# Altium schematic sheet main.SchDoc
size A0
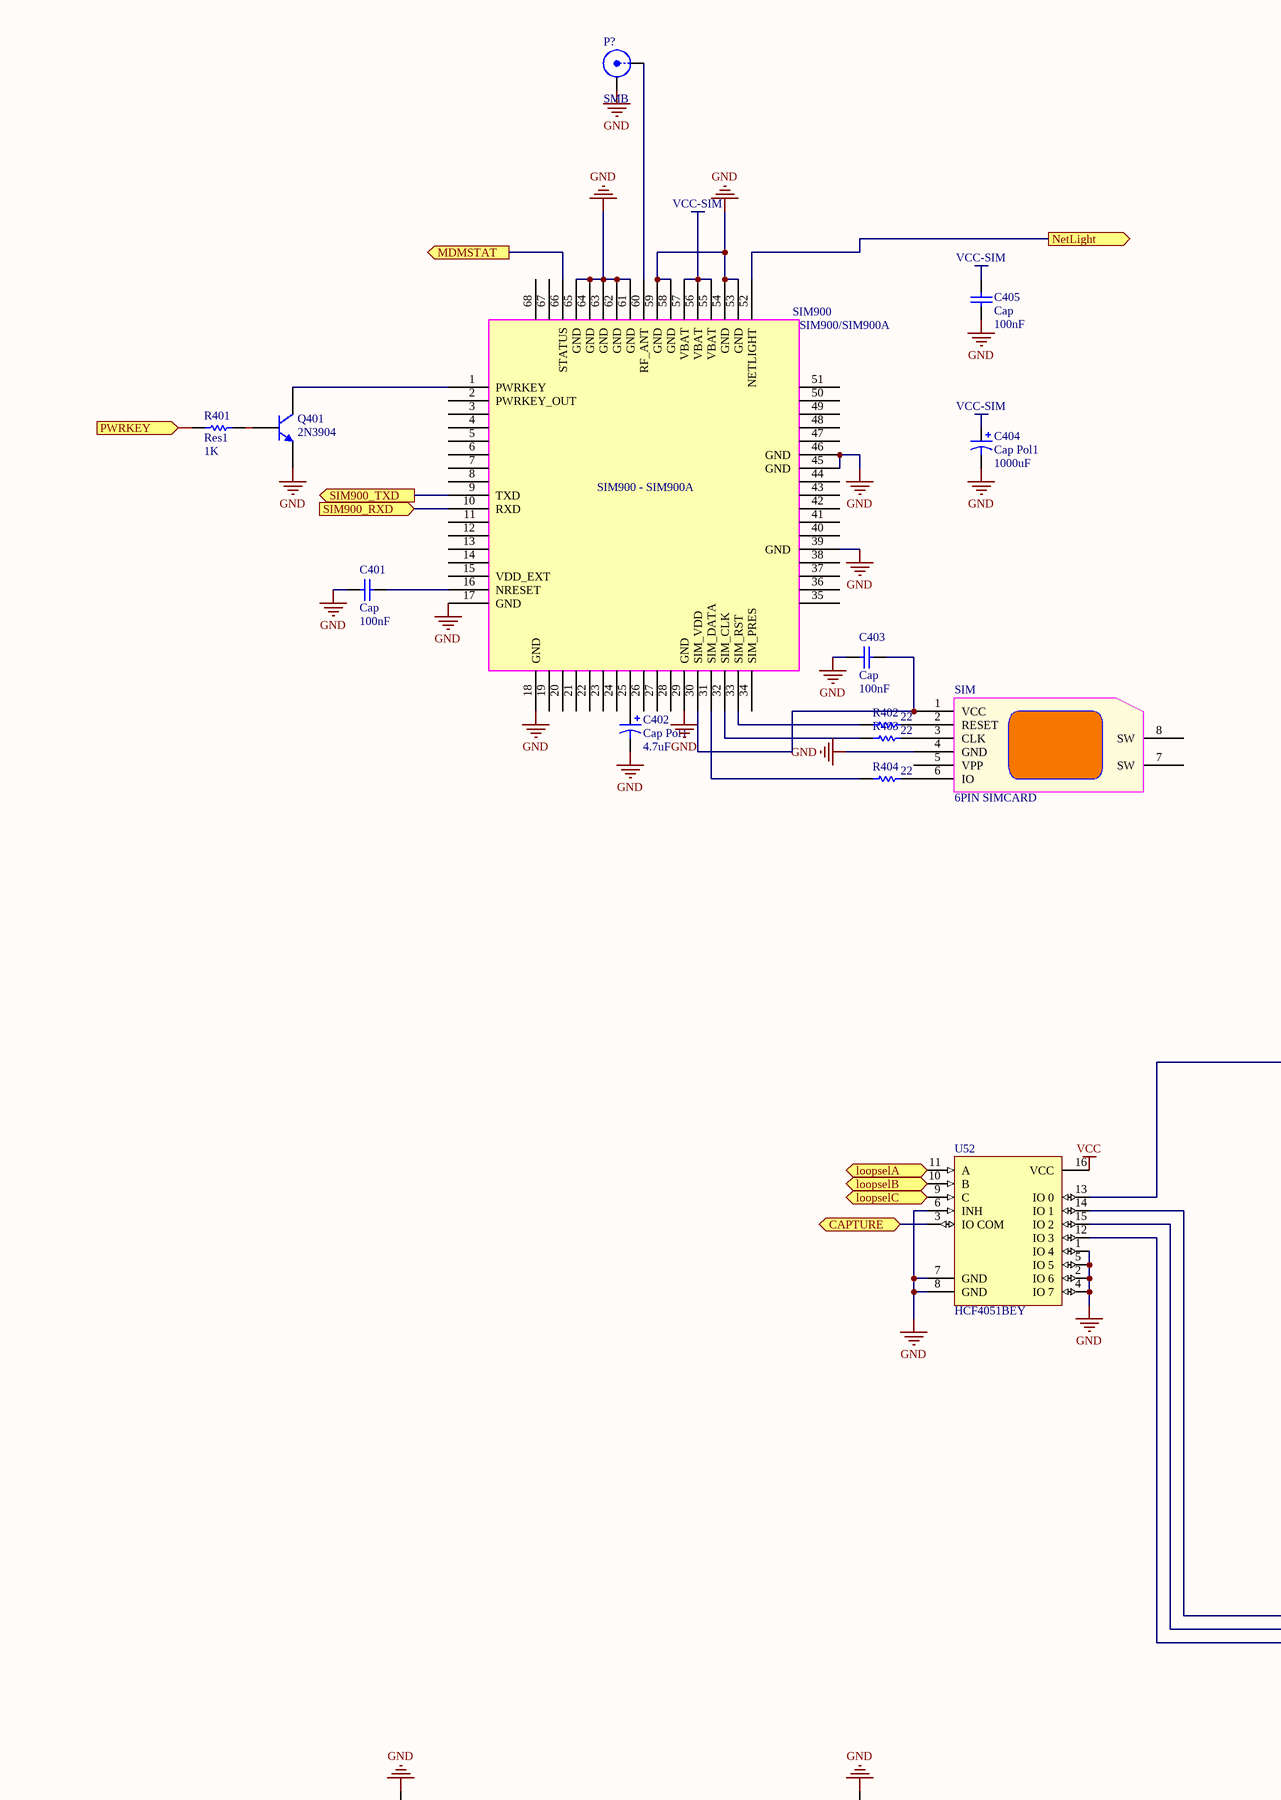
[diagram p0: main.SchDoc, top left]
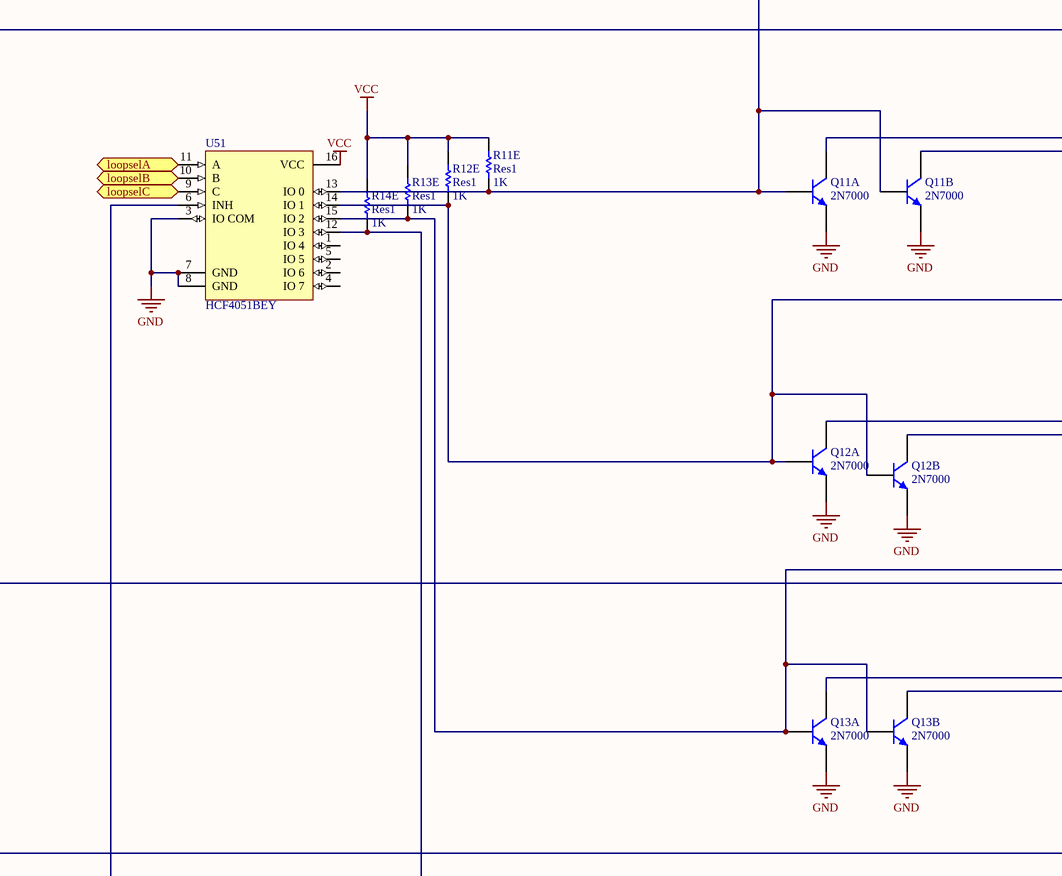
[diagram p1: main.SchDoc, top middle]
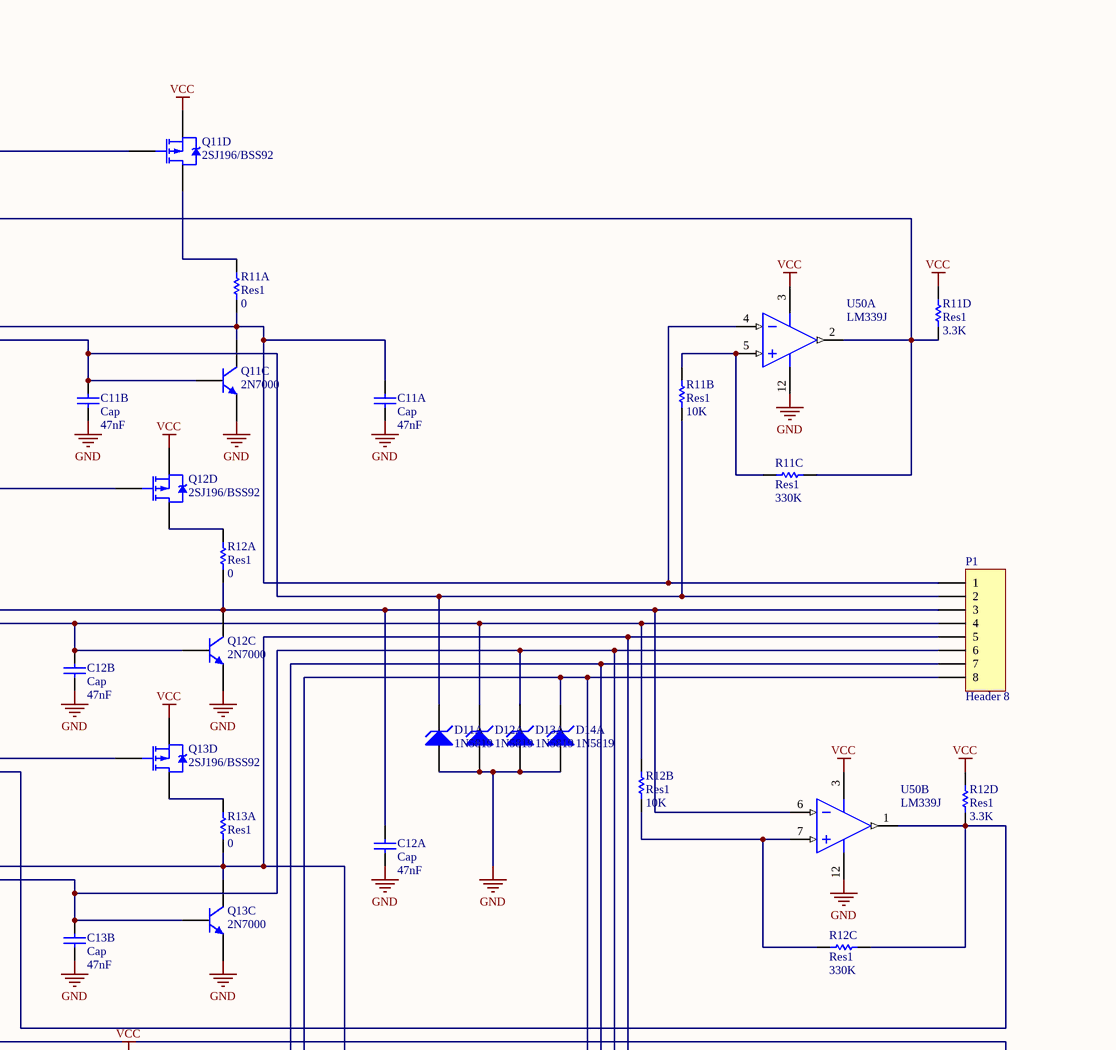
[diagram p2: main.SchDoc, top right]
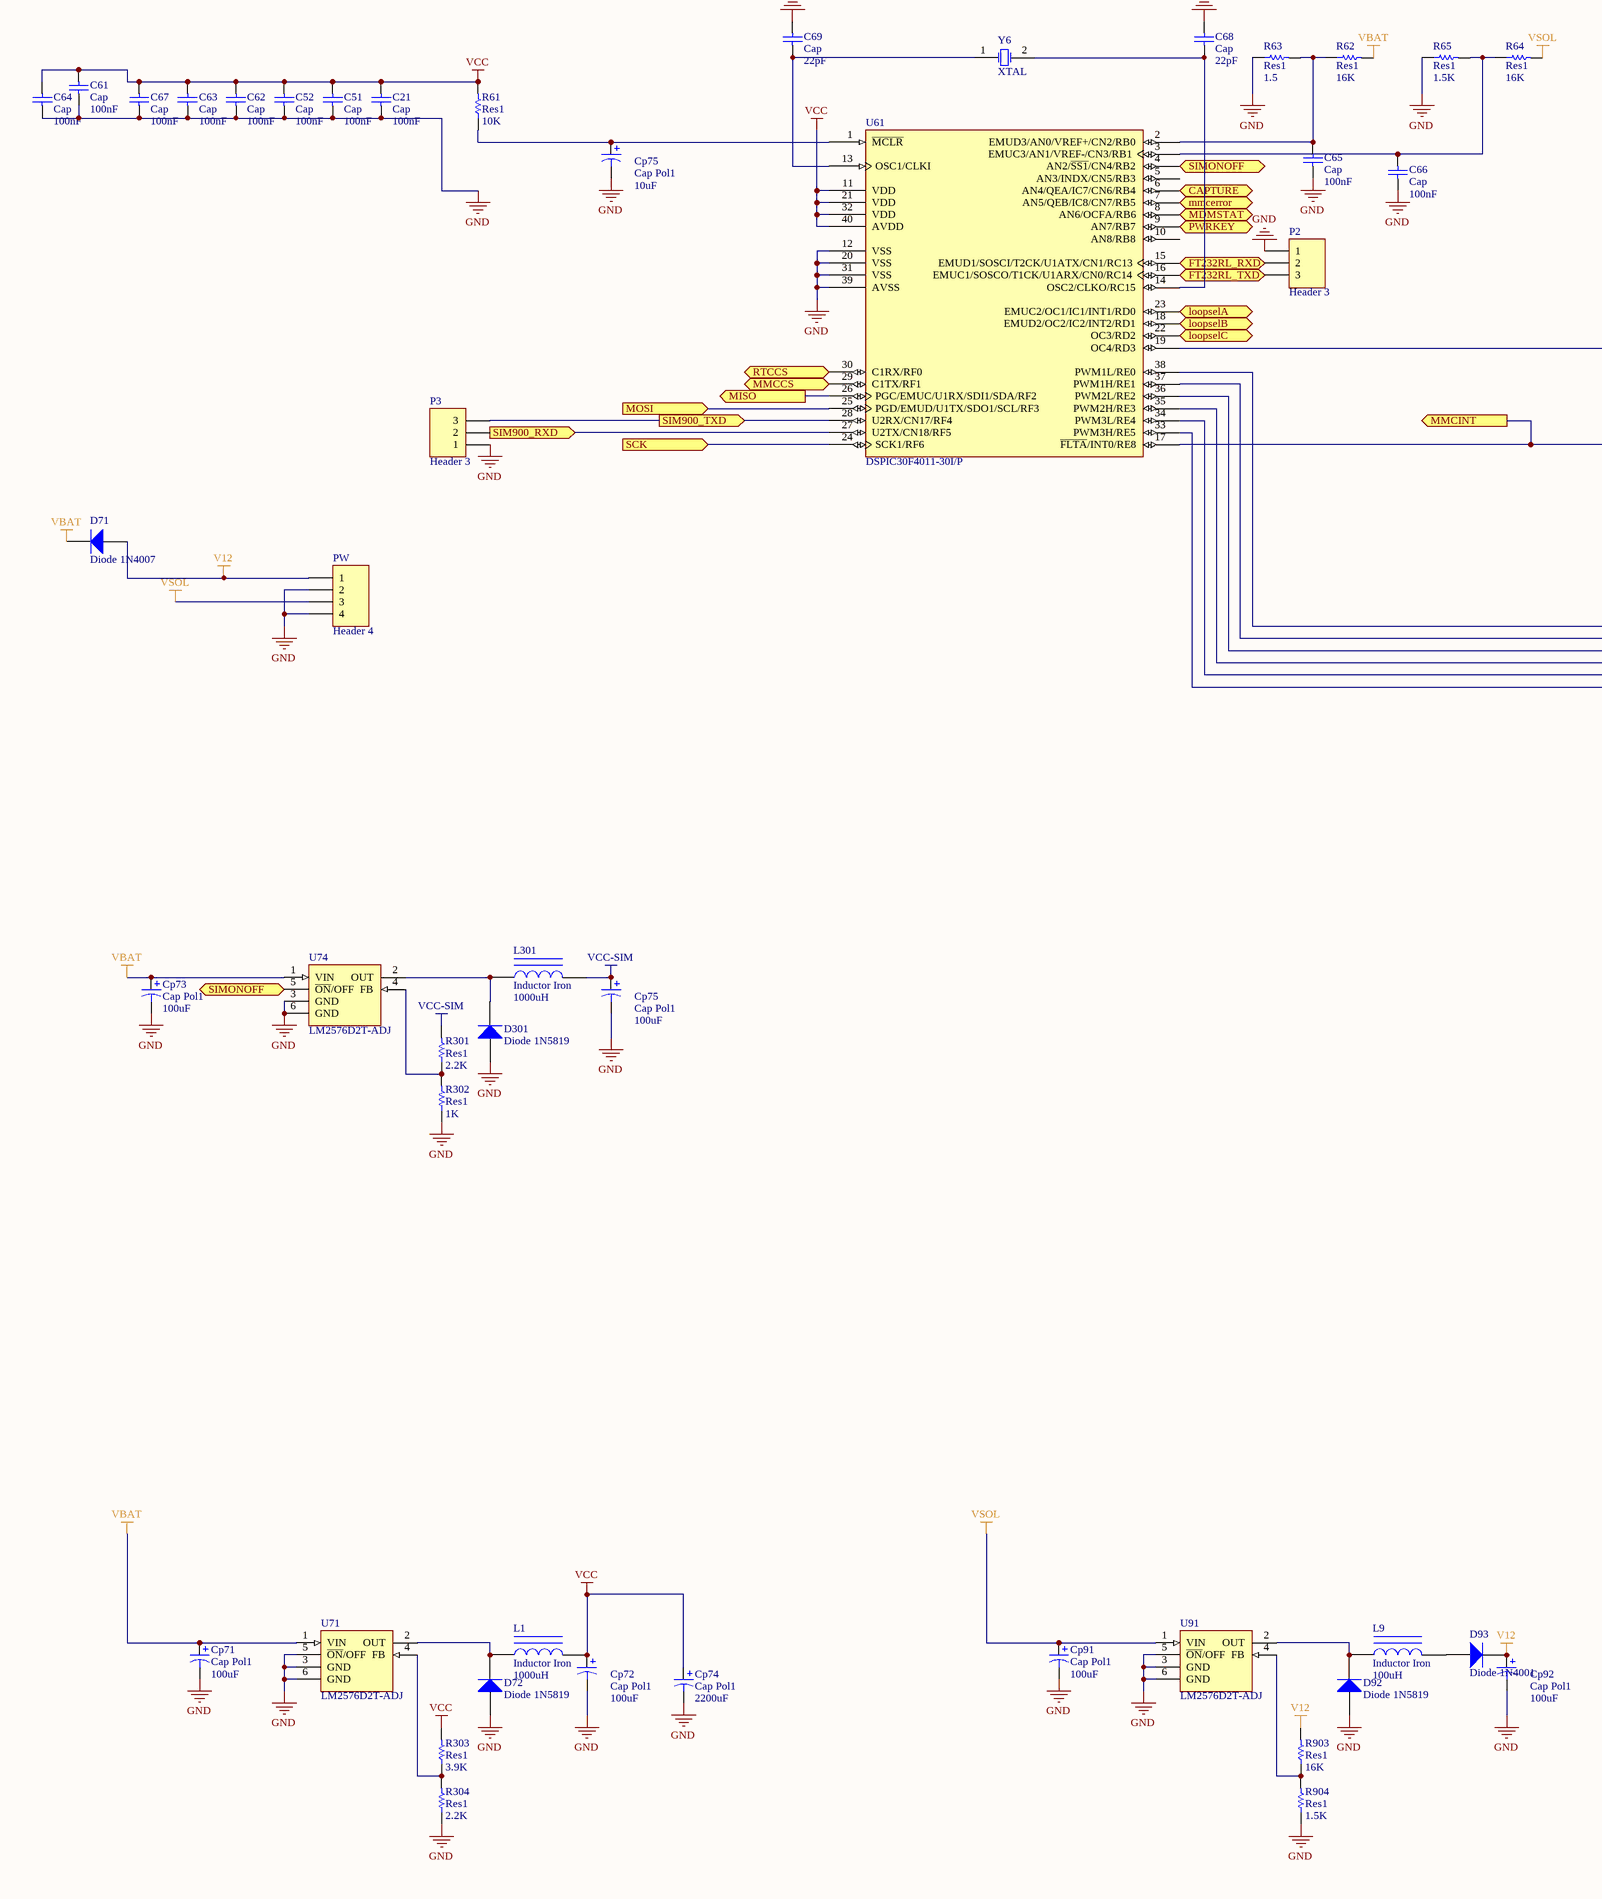
[diagram p3: main.SchDoc, bottom left]
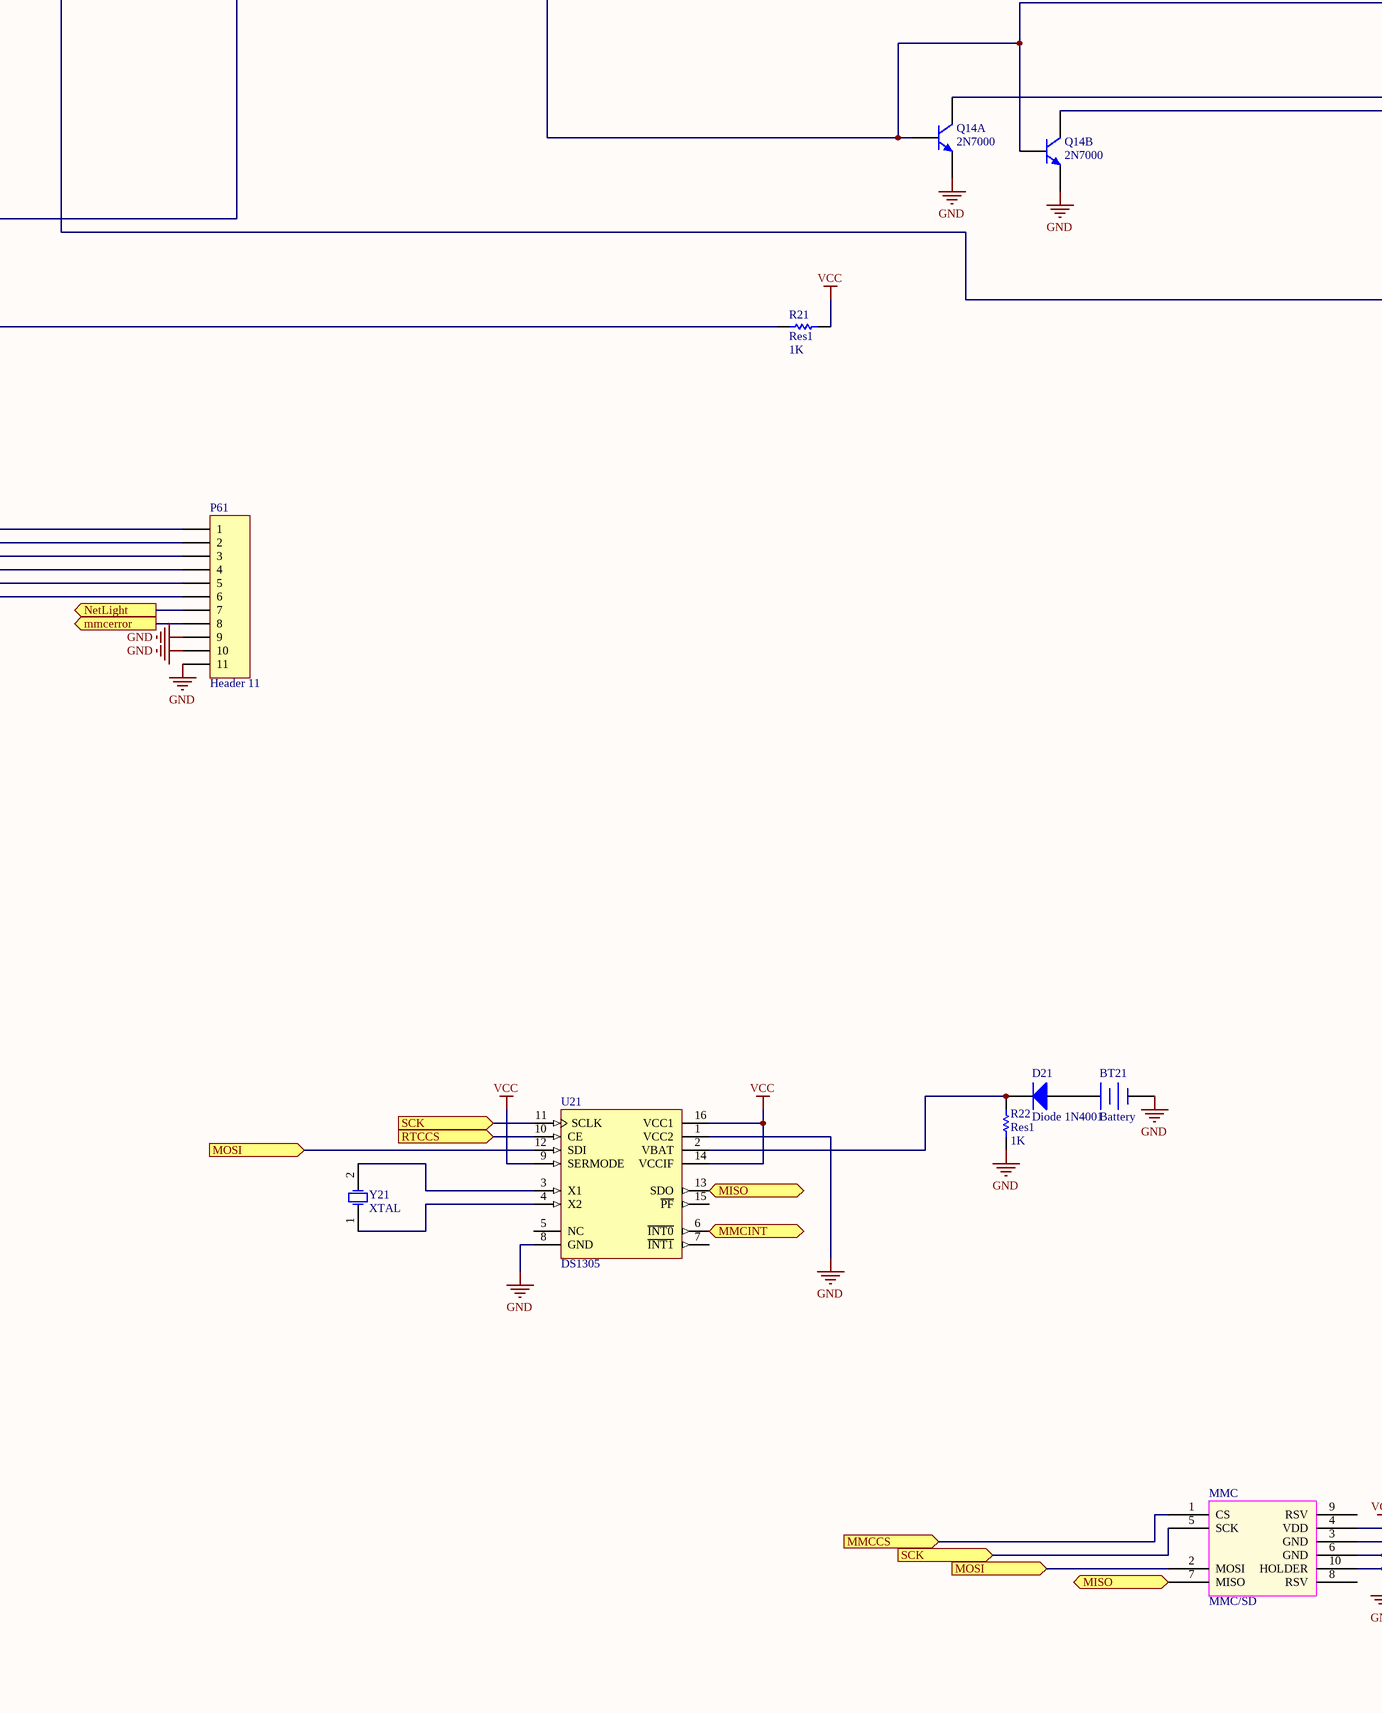
[diagram p4: main.SchDoc, bottom middle]
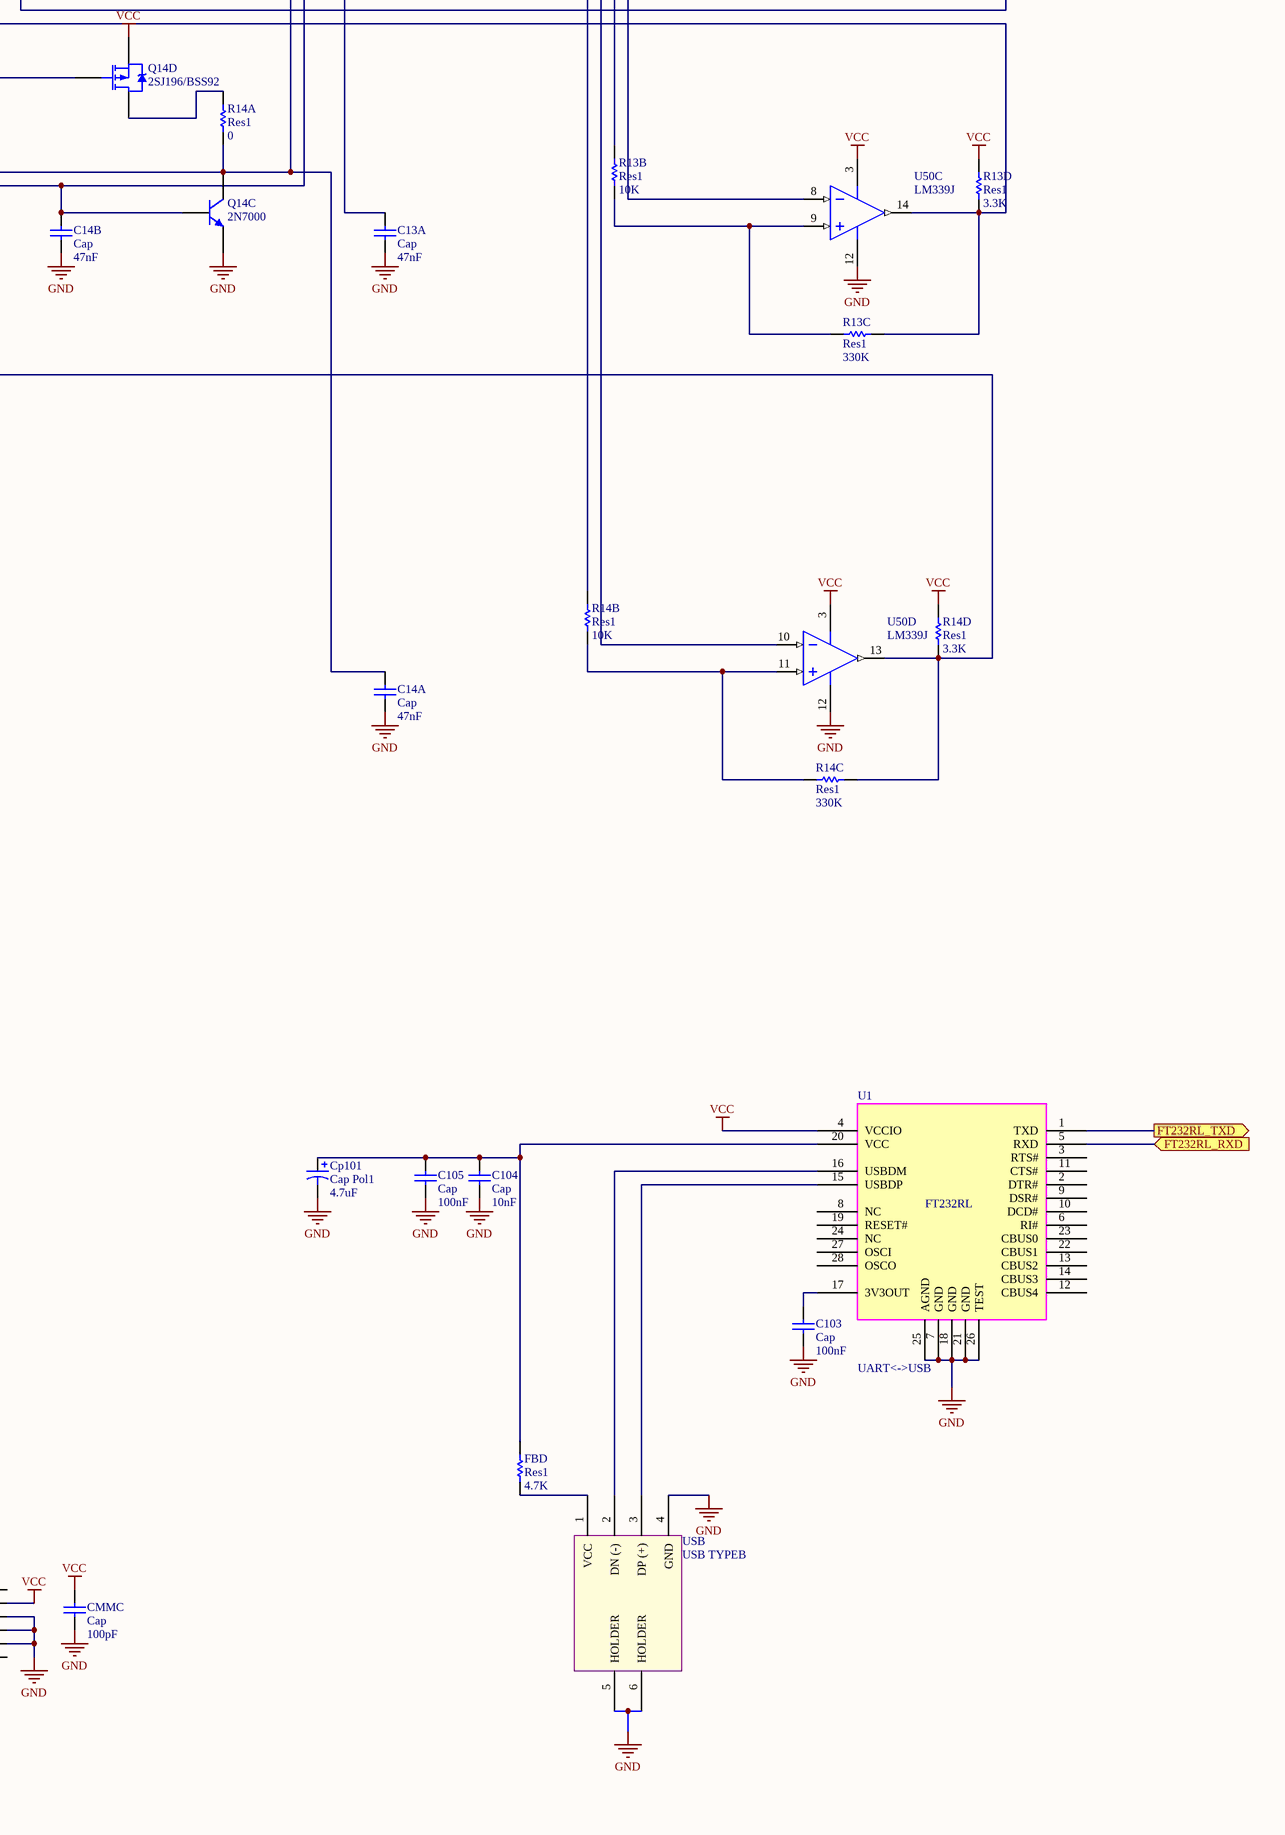
[diagram p5: main.SchDoc, bottom right]

## Parts
(Parts that share a designator on the sheet are numbered #1, #2 ... from top to bottom, then left to right.)
BT21  Battery  [coinbattery]
C11A  Cap  value 47nF  [RAD-0.3]
C11B  Cap  value 47nF  [RAD-0.3]
C12A  Cap  value 47nF  [RAD-0.3]
C12B  Cap  value 47nF  [RAD-0.3]
C13A  Cap  value 47nF  [RAD-0.3]
C13B  Cap  value 47nF  [RAD-0.3]
C14A  Cap  value 47nF  [RAD-0.3]
C14B  Cap  value 47nF  [RAD-0.3]
C21  Cap  value 100nF  [CAPR2.54-4x2.5]
C51  Cap  value 100nF  [CAPR2.54-4x2.5]
C52  Cap  value 100nF  [CAPR2.54-4x2.5]
C61  Cap  value 100nF  [CAPR2.54-4x2.5]
C62  Cap  value 100nF  [CAPR2.54-4x2.5]
C63  Cap  value 100nF  [CAPR2.54-4x2.5]
C64  Cap  value 100nF  [CAPR2.54-4x2.5]
C65  Cap  value 100nF  [CAPR2.54-4x2.5]
C66  Cap  value 100nF  [CAPR2.54-4x2.5]
C67  Cap  value 100nF  [CAPR2.54-4x2.5]
C68  Cap  value 22pF  [0805]
C69  Cap  value 22pF  [0805]
C103  Cap  value 100nF  [CAPR2.54-4x2.5]
C104  Cap  value 10nF  [CAPR2.54-4x2.5]
C105  Cap  value 100nF  [CAPR2.54-4x2.5]
C401  Cap  value 100nF  [CAPR2.54-4x2.5]
C402  Cap Pol1  value 4.7uF  [CAPPR5-5x11]
C403  Cap  value 100nF  [CAPR2.54-4x2.5]
C404  Cap Pol1  value 1000uF  [CAPPR5-10x12.5]
C405  Cap  value 100nF  [CAPR2.54-4x2.5]
CMMC  Cap  value 100pF  [CAPR2.54-4x2.5]
Cp71  Cap Pol1  value 100uF  [CAPPR2.5-6.3x11]
Cp72  Cap Pol1  value 100uF  [CAPPR2.5-6.3x11]
Cp73  Cap Pol1  value 100uF  [CAPPR2.5-6.3x11]
Cp74  Cap Pol1  value 2200uF  [CAPPR5-10x12.5]
Cp75#1  Cap Pol1  value 10uF  [CAPPR2.5-6.3x11]
Cp75#2  Cap Pol1  value 100uF  [CAPPR2.5-6.3x11]
Cp91  Cap Pol1  value 100uF  [CAPPR2.5-6.3x11]
Cp92  Cap Pol1  value 100uF  [CAPPR2.5-6.3x11]
Cp101  Cap Pol1  value 4.7uF  [CAPPR5-5x11]
D11A  1N5819  [DIODE-0.4]
D12A  1N5819  [DIODE-0.4]
D13A  1N5819  [DIODE-0.4]
D14A  1N5819  [DIODE-0.4]
D21  Diode 1N4001  [DO-41]
D71  Diode 1N4007  [DO-41]
D72  Diode 1N5819  [DO-41]
D92  Diode 1N5819  [DO-41]
D93  Diode 1N4001  [DO-41]
D301  Diode 1N5819  [DO-41]
FBD  Res1  value 4.7K  [AXIAL-0.3]
L1  Inductor Iron  value 1000uH  [CAPPR5-6.3x15]
L9  Inductor Iron  value 100uH  [CAPPR5-6.3x15]
L301  Inductor Iron  value 1000uH  [CAPPR5-8x12]
MMC  MMC/SD  [MC/SM2.5-4H9]
P1  Header 8  [phoenix8]
P2  Header 3  [HDR1X3]
P3  Header 3  [HDR1X3]
P61  Header 11  [HDR1X11]
P?  SMB  [SMB_V-RJ45]
PW  Header 4  [phoenix4]
Q11A  2N7000  [2sj196]
Q11B  2N7000  [2sj196]
Q11C  2N7000  [2sj196]
Q11D  2SJ196/BSS92  [2sj196new]
Q12A  2N7000  [2sj196]
Q12B  2N7000  [2sj196]
Q12C  2N7000  [2sj196]
Q12D  2SJ196/BSS92  [2sj196new]
Q13A  2N7000  [2sj196]
Q13B  2N7000  [2sj196]
Q13C  2N7000  [2sj196]
Q13D  2SJ196/BSS92  [2sj196new]
Q14A  2N7000  [2sj196]
Q14B  2N7000  [2sj196]
Q14C  2N7000  [2sj196]
Q14D  2SJ196/BSS92  [2sj196new]
Q401  2N3904  [2n7000]
R11A  Res1  value 0  [AXIAL-0.3]
R11B  Res1  value 10K  [AXIAL-0.3]
R11C  Res1  value 330K  [AXIAL-0.3]
R11D  Res1  value 3.3K  [AXIAL-0.3]
R11E  Res1  value 1K  [AXIAL-0.3]
R12A  Res1  value 0  [AXIAL-0.3]
R12B  Res1  value 10K  [AXIAL-0.3]
R12C  Res1  value 330K  [AXIAL-0.3]
R12D  Res1  value 3.3K  [AXIAL-0.3]
R12E  Res1  value 1K  [AXIAL-0.3]
R13A  Res1  value 0  [AXIAL-0.3]
R13B  Res1  value 10K  [AXIAL-0.3]
R13C  Res1  value 330K  [AXIAL-0.3]
R13D  Res1  value 3.3K  [AXIAL-0.3]
R13E  Res1  value 1K  [AXIAL-0.3]
R14A  Res1  value 0  [AXIAL-0.3]
R14B  Res1  value 10K  [AXIAL-0.3]
R14C  Res1  value 330K  [AXIAL-0.3]
R14D  Res1  value 3.3K  [AXIAL-0.3]
R14E  Res1  value 1K  [AXIAL-0.3]
R21  Res1  value 1K  [AXIAL-0.3]
R22  Res1  value 1K  [AXIAL-0.3]
R61  Res1  value 10K  [AXIAL-0.3]
R62  Res1  value 16K  [AXIAL-0.3]
R63  Res1  value 1.5  [AXIAL-0.3]
R64  Res1  value 16K  [AXIAL-0.3]
R65  Res1  value 1.5K  [AXIAL-0.3]
R301  Res1  value 2.2K  [AXIAL-0.3]
R302  Res1  value 1K  [AXIAL-0.3]
R303  Res1  value 3.9K  [AXIAL-0.3]
R304  Res1  value 2.2K  [AXIAL-0.3]
R401  Res1  value 1K  [AXIAL-0.3]
R402  value 22  [AXIAL-0.3]
R403  value 22  [AXIAL-0.3]
R404  value 22  [AXIAL-0.3]
R903  Res1  value 16K  [AXIAL-0.3]
R904  Res1  value 1.5K  [AXIAL-0.3]
SIM  6PIN SIMCARD  [sim6pinn]
SIM900  SIM900/SIM900A  [SIM900]
U1  UART<->USB  [FT232RL]
U21  DS1305  [dip16]
U50  LM339J  [J14A]  (parts A,B,C,D of 4)
U51  HCF4051BEY  [DIP16]
U52  HCF4051BEY  [DIP16]
U61  DSPIC30F4011-30I/P  [PDIP600-P40]
U71  LM2576D2T-ADJ  [936A-02]
U74  LM2576D2T-ADJ  [936A-02]
U91  LM2576D2T-ADJ  [936A-02]
USB  USB TYPEB  [USB2.5-2H4D]
Y6  XTAL  [BCY-W2/E4.7]
Y21  XTAL  [BCY-W2/D3.1]

## Ports
CAPTURE, FT232RL_RXD (in), FT232RL_TXD (out), loopselA, loopselB, loopselC, MDMSTAT (out), MISO (out), MMCCS (in), MMCCS (out), mmcerror (out), MMCINT (out), MOSI (in), NetLight (out), PWRKEY (in), RTCCS (in), RTCCS (out), SCK (in), SIM900_RXD (in), SIM900_TXD (out), SIMONOFF

## Nets
GND: BT21.2(-) C11A.1 C11B.1 C12A.1 C12B.1 C13A.1 C13B.1 C14A.1 C14B.1 C21.1 C51.1 C52.1 C61.1 C62.1 C63.1 C64.1 C65.1 C66.1 C67.1 C68.2 C69.2 C103.1 C104.1 C105.1 C401.1 C402.2 C403.1 C404.2 C405.1 CMMC.1 Cp71.2 Cp72.2 Cp73.2 Cp74.2 Cp75#1.2 Cp75#2.2 Cp91.2 Cp92.2 Cp101.2 D11A.1(A) D12A.1(A) D13A.1(A) D14A.1(A) D72.1(A) D92.1(A) D301.1(A) MMC.3(GND) MMC.6(GND) MMC.10(HOLDER) P2.1 P3.1 P61.9 P61.10 P61.11 P?.2(Y) PW.2 PW.4 Q11A.1(E) Q11B.1(E) Q11C.1(E) Q12A.1(E) Q12B.1(E) Q12C.1(E) Q13A.1(E) Q13B.1(E) Q13C.1(E) Q14A.1(E) Q14B.1(E) Q14C.1(E) Q401.1(E) R22.1 R63.1 R65.1 R302.1 R304.1 R904.1 SIM.4(GND) SIM900.17(GND) SIM900.18(GND) SIM900.29(GND) SIM900.39(GND) SIM900.45(GND) SIM900.46(GND) SIM900.53(GND) SIM900.54(GND) SIM900.58(GND) SIM900.59(GND) SIM900.61(GND) SIM900.62(GND) SIM900.63(GND) SIM900.64(GND) SIM900.65(GND) U1.7(GND) U1.18(GND) U1.21(GND) U1.25(AGND) U1.26(TEST) U21.1(VCC2) U21.8(GND) U50.12(GND) U51.3(IO_COM) U51.7(GND) U51.8(GND) U52.1(IO_4) U52.2(IO_6) U52.4(IO_7) U52.5(IO_5) U52.6(INH) U52.7(GND) U52.8(GND) U61.12(VSS) U61.20(VSS) U61.31(VSS) U61.39(AVSS) U71.3(GND) U71.5(~{ON}/OFF) U71.6(GND) U74.3(GND) U74.6(GND) U91.3(GND) U91.5(~{ON}/OFF) U91.6(GND) USB.4(GND) USB.5(HOLDER) USB.6(HOLDER)
V12: Cp92.1 D71.1(A) D93.2(K) PW.1 R903.2
VBAT: Cp71.1 Cp73.1 D71.2(K) R62.2 U71.1(VIN) U74.1(VIN)
VCC: C21.2 C51.2 C52.2 C61.2 C62.2 C63.2 C64.2 C67.2 CMMC.2 Cp72.1 Cp74.1 L1.2 MMC.4(VDD) Q11D.3(S) Q12D.3(S) Q13D.3(S) Q14D.3(S) R11D.2 R11E.2 R12D.2 R12E.2 R13D.2 R13E.2 R14D.2 R14E.2 R21.2 R61.2 R303.2 U1.4(VCCIO) U21.9(SERMODE) U21.14(VCCIF) U21.16(VCC1) U50.3(V+) U51.16(VCC) U52.16(VCC) U61.11(VDD) U61.21(VDD) U61.32(VDD) U61.40(AVDD)
VCC-SIM: C404.1 C405.2 Cp75#2.1 L301.2 R301.2 SIM900.55(VBAT) SIM900.56(VBAT) SIM900.57(VBAT)
VSOL: Cp91.1 PW.3 R64.2 U91.1(VIN)
CAPTURE: U52.3(IO_COM) U61.6(AN4/QEA/IC7/CN6/RB4) ; port CAPTURE
FT232RL_RXD: P2.2 U1.5(RXD) U61.15(EMUD1/SOSCI/T2CK/U1ATX/CN1/RC13) ; port FT232RL_RXD
FT232RL_TXD: P2.3 U1.1(TXD) U61.16(EMUC1/SOSCO/T1CK/U1ARX/CN0/RC14) ; port FT232RL_TXD
loopselA: U51.11(A) U52.11(A) U61.23(EMUC2/OC1/IC1/INT1/RD0) ; port loopselA
loopselB: U51.10(B) U52.10(B) U61.18(EMUD2/OC2/IC2/INT2/RD1) ; port loopselB
loopselC: U51.9(C) U52.9(C) U61.22(OC3/RD2) ; port loopselC
MDMSTAT: SIM900.66(STATUS) U61.8(AN6/OCFA/RB6) ; port MDMSTAT
MISO: MMC.7(MISO) U21.13(SDO) U61.26(PGC/EMUC/U1RX/SDI1/SDA/RF2) ; port MISO
MMCCS: MMC.1(CS) U61.29(C1TX/RF1) ; port MMCCS
mmcerror: P61.8 U61.7(AN5/QEB/IC8/CN7/RB5) ; port mmcerror
MMCINT: R21.1 U21.6(~{INT0}) U61.17(~{FLTA}/INT0/RE8) ; port MMCINT
MOSI: MMC.2(MOSI) U21.12(SDI) U61.25(PGD/EMUD/U1TX/SDO1/SCL/RF3) ; port MOSI
NetLight: P61.7 SIM900.52(NETLIGHT) ; port NetLight
PWRKEY: R401.1 U61.9(AN7/RB7) ; port PWRKEY
RTCCS: U21.10(CE) U61.30(C1RX/RF0) ; port RTCCS
SCK: MMC.5(SCK) U21.11(SCLK) U61.24(SCK1/RF6) ; port SCK
SIM900_RXD: P3.2 SIM900.10(RXD) U61.27(U2TX/CN18/RF5) ; port SIM900_RXD
SIM900_TXD: P3.3 SIM900.9(TXD) U61.28(U2RX/CN17/RF4) ; port SIM900_TXD
SIMONOFF: U61.4(AN2/~{SS1}/CN4/RB2) U74.5(~{ON}/OFF) ; port SIMONOFF
NetBT21_1: BT21.1(+) D21.1(A)
NetC11A_2: C11A.2 P1.1 Q11A.3(C) Q11C.3(C) R11A.1 U50.4(IN1-)
NetC11B_2: C11B.2 D11A.2(K) P1.2 Q11B.3(C) Q11C.2(B) R11B.1
NetC12A_2: C12A.2 P1.3 Q12A.3(C) Q12C.3(C) R12A.1 U50.6(IN2-)
NetC12B_2: C12B.2 D12A.2(K) P1.4 Q12B.3(C) Q12C.2(B) R12B.2
NetC13A_2: C13A.2 P1.5 Q13A.3(C) Q13C.3(C) R13A.1 U50.8(IN3-)
NetC13B_2: C13B.2 D13A.2(K) P1.6 Q13B.3(C) Q13C.2(B) R13B.2
NetC14A_2: C14A.2 P1.7 Q14A.3(C) Q14C.3(C) R14A.1 U50.10(IN4-)
NetC14B_2: C14B.2 D14A.2(K) P1.8 Q14B.3(C) Q14C.2(B) R14B.2
NetC65_2: C65.2 R62.1 R63.2 U61.2(EMUD3/AN0/VREF+/CN2/RB0)
NetC66_2: C66.2 R64.1 R65.2 U61.3(EMUC3/AN1/VREF-/CN3/RB1)
NetC68_1: C68.1 U61.14(OSC2/CLKO/RC15) Y6.2(OSC2)
NetC69_1: C69.1 U61.13(OSC1/CLKI) Y6.1(OSC1)
NetC103_2: C103.2 U1.17(3V3OUT)
NetC104_2: C104.2 C105.2 Cp101.1 FBD.2 U1.20(VCC)
NetC401_2: C401.2 SIM900.16(NRESET)
NetC402_1: C402.1 SIM900.25
NetC403_2: C403.2 SIM.1(VCC) SIM900.30(SIM_VDD)
NetCp75#1_1: Cp75#1.1 R61.1 U61.1(~{MCLR})
NetD21_2: D21.2(K) R22.2 U21.2(VBAT)
NetD72_2: D72.2(K) L1.1 U71.2(OUT)
NetD92_2: D92.2(K) L9.1 U91.2(OUT)
NetD93_1: D93.1(A) L9.2
NetD301_2: D301.2(K) L301.1 U74.2(OUT)
NetFBD_1: FBD.1 USB.1(VCC)
NetP61_1: P61.1 U61.38(PWM1L/RE0)
NetP61_2: P61.2 U61.37(PWM1H/RE1)
NetP61_3: P61.3 U61.36(PWM2L/RE2)
NetP61_4: P61.4 U61.35(PWM2H/RE3)
NetP61_5: P61.5 U61.34(PWM3L/RE4)
NetP61_6: P61.6 U61.33(PWM3H/RE5)
NetP?_1: P?.1(X) SIM900.60(RF_ANT)
NetQ11A_2: Q11A.2(B) Q11B.2(B) Q11D.1(G) R11E.1 U51.13(IO_0)
NetQ11D_2: Q11D.2(D) R11A.2
NetQ12A_2: Q12A.2(B) Q12B.2(B) Q12D.1(G) R12E.1 U51.14(IO_1)
NetQ12D_2: Q12D.2(D) R12A.2
NetQ13A_2: Q13A.2(B) Q13B.2(B) Q13D.1(G) R13E.1 U51.15(IO_2)
NetQ13D_2: Q13D.2(D) R13A.2
NetQ14A_2: Q14A.2(B) Q14B.2(B) Q14D.1(G) R14E.1 U51.12(IO_3)
NetQ14D_2: Q14D.2(D) R14A.2
NetQ401_2: Q401.2(B) R401.2
NetQ401_3: Q401.3(C) SIM900.1(PWRKEY)
NetR11B_2: R11B.2 R11C.1 U50.5(IN1+)
NetR11C_2: R11C.2 R11D.1 U50.2(OUT1) U52.13(IO_0)
NetR12B_1: R12B.1 R12C.1 U50.7(IN2+)
NetR12C_2: R12C.2 R12D.1 U50.1(OUT2) U52.14(IO_1)
NetR13B_1: R13B.1 R13C.1 U50.9(IN3+)
NetR13C_2: R13C.2 R13D.1 U50.14(OUT3) U52.15(IO_2)
NetR14B_1: R14B.1 R14C.1 U50.11(IN4+)
NetR14C_2: R14C.2 R14D.1 U50.13(OUT4) U52.12(IO_3)
NetR301_1: R301.1 R302.2 U74.4(FB)
NetR303_1: R303.1 R304.2 U71.4(FB)
NetR402_1: R402.1 SIM900.33(SIM_RST)
NetR402_2: R402.2 SIM.2(RESET)
NetR403_1: R403.1 SIM900.32(SIM_CLK)
NetR403_2: R403.2 SIM.3(CLK)
NetR404_1: R404.1 SIM900.31(SIM_DATA)
NetR404_2: R404.2 SIM.6(IO)
NetR903_1: R903.1 R904.2 U91.4(FB)
NetU1_15: U1.15(USBDP) USB.3(DP_(+))
NetU1_16: U1.16(USBDM) USB.2(DN_(-))
NetU21_3: U21.3(X1) Y21.2(OSC2)
NetU21_4: U21.4(X2) Y21.1(OSC1)
NetU51_6: U51.6(INH) U61.19(OC4/RD3)

Not connected (* = marked no-connect by the designer): MMC 8(RSV) 9(RSV); SIM 5(VPP) 7(SW) 8(SW); SIM900 2(PWRKEY_OUT) 3 4 5 6 7 8 11 12 13 14 15(VDD_EXT) 19 20 21 22 23 24 26 27 28 34(SIM_PRES) 35 36 37 38 40 41 42 43 44 47 48 49 50 51 67 68; U1 2(DTR#) 3(RTS#) 6(RI#) 8(NC) 9(DSR#) 10(DCD#) 11(CTS#) 12(CBUS4) 13(CBUS2) 14(CBUS3) 19(RESET#) 22(CBUS1) 23(CBUS0) 24(NC) 27(OSCI) 28(OSCO); U21 5(NC) 7(~{INT1}) 15(~{PF}); U51 1(IO_4) 2(IO_6) 4(IO_7) 5(IO_5); U61 5(AN3/INDX/CN5/RB3) 10(AN8/RB8)

## Notes on the sheet
- (in symbol Component_1) FT232RL
- (in symbol SIM900) SIM900 - SIM900A

## Library data of the parts
BT21 = Battery: Multicell Battery; Published: 24-Mar-1999; LatestRevisionDate: 17-Jul-2002; LatestRevisionNote: Re-released for DXP Platform.; PackageReference: BAT-2; Publisher: Altium Limited; PackageDescription: Battery; 2 Leads
C11A C11B C12A C12B C13A C13B C14A C14B C21 C51 C52 C61-C69 C103-C105 C401 C403 C405 CMMC = Cap: Capacitor; Published: 8-Jun-2000; LatestRevisionDate: 17-Jul-2002; LatestRevisionNote: Re-released for DXP Platform.; PackageReference: RAD-0.3; Publisher: Altium Limited; PackageDescription: Radial Cap, Thru-Hole; 2 Leads; 0.3 in Pin Spacing
C402 C404 Cp71-Cp74 Cp75#1 Cp75#2 Cp91 Cp92 Cp101 = Cap Pol1: Polarized Capacitor (Radial); Published: 8-Jun-2000; LatestRevisionDate: 17-Jul-2002; LatestRevisionNote: Re-released for DXP Platform.; PackageReference: RB7.6-15; Publisher: Altium Limited; PackageDescription: Polarized Capacitor (Radial); 2 Leads
D11A D12A D13A D14A = 1N4750A: One Watt Zener; Published: 8-Jun-2000; LatestRevisionDate: 17-Jul-2002; LatestRevisionNote: Re-released for DXP Platform.; DatasheetDocument: 1997; PackageDocument: Aug-1999; PackageReference: DO-41; Publisher: Altium Limited; Code_JEDEC: DO-204-AL; ComponentLink1Description: Manufacturer Link; ComponentLink1URL: http://www.fairchildsemi.com/; ComponentLink2Description: Datasheet; ComponentLink2URL: http://www.fairchildsemi.com/ds/1N%2F1N4728A.pdf
D21 D72 D92 D93 D301 = Diode 1N4001: 1 Amp General Purpose Rectifier; Published: 8-Jun-2000; LatestRevisionDate: 17-Jul-2002; LatestRevisionNote: Re-released for DXP Platform.; DatasheetVersion: 1998; PackageVersion: Aug-1999; PackageReference: DO-41; Publisher: Altium Limited; PackageDescription: Diode, Axial; Body 5.2 x 2.7 mm (LxDia. max), Lead Dia. 0.86 mm (max); Code_JEDEC: DO-204-AL; ComponentLink1Description: Manufacturer Link; ComponentLink1URL: http://www.fairchildsemi.com/; ComponentLink2Description: Datasheet; ComponentLink2URL: http://www.fairchildsemi.com/ds/1N%2F1N4001.pdf
D71 = Diode 1N4007: 1 Amp General Purpose Rectifier; Published: 8-Jun-2000; LatestRevisionDate: 17-Jul-2002; LatestRevisionNote: Re-released for DXP Platform.; DatasheetVersion: 1998; PackageVersion: Aug-1999; PackageReference: DO-41; Publisher: Altium Limited; PackageDescription: Diode, Axial; Body 5.2 x 2.7 mm (LxDia. max), Lead Dia. 0.86 mm (max); Code_JEDEC: DO-204-AL; ComponentLink1Description: Manufacturer Link; ComponentLink1URL: http://www.fairchildsemi.com/; ComponentLink2Description: Datasheet; ComponentLink2URL: http://www.fairchildsemi.com/ds/1N%2F1N4001.pdf
FBD R11A R11B R11C R11D R11E R12A R12B R12C R12D R12E R13A R13B R13C R13D R13E R14A R14B R14C R14D R14E R21 R22 R61-R65 R301-R304 R401-R404 R903 R904 = Res1: Resistor; Published: 8-Jun-2000; LatestRevisionDate: 17-Jul-2002; LatestRevisionNote: Re-released for DXP Platform.; PackageReference: AXIAL-0.3; Publisher: Altium Limited; PackageDescription: Axial Device, Thru-Hole; 2 Leads; 0.3 in Pin Spacing
L1 L9 L301 = Inductor Iron: Magnetic-Core Inductor; Published: 24-Mar-1999; LatestRevisionDate: 17-Jul-2002; LatestRevisionNote: Re-released for DXP Platform.; PackageReference: AXIAL-0.9; Publisher: Altium Limited; PackageDescription: Axial Device, Thru-Hole; 2 Leads; 0.9 in Pin Spacing
MMC SIM U1 = Component_1
P1 = Header 8: Header, 8-Pin; LatestRevisionDate: 17-Jul-2002; LatestRevisionNote: Re-released for DXP Platform.; Publisher: Altium Limited
P2 P3 = Header 3: Header, 3-Pin; LatestRevisionDate: 17-Jul-2002; LatestRevisionNote: Re-released for DXP Platform.; Publisher: Altium Limited
P61 = Header 11: Header, 11-Pin; LatestRevisionDate: 17-Jul-2002; LatestRevisionNote: Re-released for DXP Platform.; Publisher: Altium Limited
P? = SMB: SMB Straight Connector; LatestRevisionDate: 17-Jul-2002; LatestRevisionNote: Re-released for DXP Platform.; Publisher: Altium Limited
PW = Header 4: Header, 4-Pin; LatestRevisionDate: 17-Jul-2002; LatestRevisionNote: Re-released for DXP Platform.; Publisher: Altium Limited
Q11A Q11B Q11C Q12A Q12B Q12C Q13A Q13B Q13C Q14A Q14B Q14C Q401 = 2N3904: NPN General Purpose Amplifier; Published: 8-Jun-2000; DatasheetVersion: 1997; PackageVersion: Sep-1998; PackageReference: TO-92A; Publisher: Altium Limited; PackageDescription: TO, Flat Index; 3 In-Line, Axial Leads; Body Dia. 4.5mm; Leads 0.51 x 0.48 mm (max); ComponentLink1Description: Manufacturer Link; ComponentLink1URL: http://www.fairchildsemi.com/; ComponentLink2Description: Datasheet; ComponentLink2URL: http://www.fairchildsemi.com/ds/2N%2F2N3904.pdf
  Q11A Q11B Q11C Q12A Q12B Q12C Q13A Q13B Q13C Q14A Q14B Q14C: LatestRevisionDate: 17-Jan-2003; LatestRevisionNote: PCB Footprint replaced
  Q401: LatestRevisionDate: 15-Jan-2003; LatestRevisionNote: PCB Footprint 'BCY-W3/D4.7' replaced
Q11D Q12D Q13D Q14D = IRF9540N: HEXFET Power MOSFET; Note: Pin 2 is electrically connected to pin 4.; Published: 8-Jun-2000; LatestRevisionDate: 17-Jul-2002; LatestRevisionNote: Re-released for DXP Platform.; DatasheetVersion: May-1998; PackageVersion: Feb-1997; PackageReference: TO-220AB; Publisher: Altium Limited; PackageDescription: TO, Thru-Hole, Vertical, Heatsink Mounted; 3 In-Line Leads; Pitch 2.54 mm; ComponentLink1Description: Manufacturer Link; ComponentLink1URL: http://www.irf.com/; ComponentLink2Description: Datasheet; ComponentLink2URL: http://www.irf.com/product-info/datasheets/data/irf9540n.pdf
SIM900 = SIM900
U21 = DS1305: Serial Alarm Real-Time Clock; Note: Pin number 5 is Not Connected (NC); Published: 13-Oct-2000; LatestRevisionDate: 17-Jul-2002; LatestRevisionNote: Re-released for DXP Platform.; DatasheetVersion: 10-Aug-1999; PackageVersion: 1999; PackageReference: DIP16; Publisher: Altium Limited; PackageDescription: DIP, 16-Pin, Row Spacing 7.62 mm, Pitch 2.54 mm; ComponentLink1Description: Manufacturer Link; ComponentLink1URL: http://www.maxim-ic.com/; ComponentLink2Description: Datasheet; ComponentLink2URL: http://pdfserv.maxim-ic.com/en/ds/DS1305.pdf; ComponentLink3Description: Discontinuation Notice; ComponentLink3URL: http://www.maxim-ic.com/qa/pdfs/non-obsolescence-letter.pdf
U50 = LM339J: Low Power Low Offset Voltage Quad Comparator, 14-pin CerDIP; Manufacturer: National Semiconductor; PackageTopMarking: NSUZXYYTT*LM339J; PowerWise: N; High-Reliability: Y; Published: 29-May-2009; DatasheetVersion: Mar-2004; PackageVersion: revJ, Jul-2002; PackageReference: J14A; Publisher: Altium Limited; PackageDescription: Cerdip, .400 x .310in Body, 14 Lead, .300in Centers, .100in Pitch; Supplier 1: Digi-Key; Supplier Part Number 1: LM339J-ND; PartNumber: LM339J; RoHS: N; PinCount: 14; CompType: Comparator; ComponentLink1Description: LM339 Datasheet; ComponentLink1URL: http://www.national.com/ds/LM/LM339.pdf; ComponentLink2Description: LM339 Web Page; ComponentLink2URL: http://www.national.com/pf/LM/LM339.html; ComponentLink3Description: J14A Package Page; ComponentLink3URL: http://www.national.com/packaging/folders/j14a.html
U51 U52 = HCF4051BEY: Analog Multiplexer/Demultiplexer; Published: 8-Jun-2000; LatestRevisionDate: 06-Jun-2005; LatestRevisionNote: Stylized 3D Model Added.; DatasheetVersion: Jun-1989; PackageVersion: Apr-1996; PackageReference: DIP16; Publisher: Altium Limited; PackageDescription: DIP; 16 Leads; Row Spacing 7.62 mm; Pitch 2.54 mm; ComponentLink1Description: Manufacturer Link; ComponentLink1URL: http://www.st.com/; ComponentLink2Description: Datasheet; ComponentLink2URL: http://www.st.com/stonline/products/literature/ds/2053/hcf4051.pdf
U61 = DSPIC30F4011-30I/P: High-Performance 16-bit Digital Signal Controller, 48 KB Flash, 2 KB SRAM, 1 KB EEPROM, 40-Pin PDIP, Industrial Temperature; Published: 29-Jan-2009; DatasheetVersion: revF, Jul-2008; PackageVersion: revBB, Aug-2009; PackageReference: PDIP600-P40; Publisher: Altium Limited; PackageDescription: 40-Lead Plastic Dual In-Line (P) - 600 mil Body [PDIP]; Supplier 1: Digi-Key; Supplier Part Number 1: DSPIC30F4011-30IP-ND; Supplier 2: Farnell; Supplier Part Number 2: 1439598; ComponentLink1Description: Datasheet; ComponentLink1URL: http://ww1.microchip.com/downloads/en/DeviceDoc/70135F.pdf; ComponentLink2Description: Packaging Specification; ComponentLink2URL: http://www.microchip.com/stellent/groups/techpub_sg/documents/packagingspec/en012702.pdf; ComponentLink3Description: Microchip.com Home; ComponentLink3URL: http://www.microchip.com/
U71 U74 U91 = LM2576D2T-ADJ: Easy Switcher 3.0A Step-Down Voltage Regulator; Note: Pin 3 is electrically connected to Pin 6;Pin 6 is heatsink; Published: 15-Apr-2002; DatasheetVersion: Jul-1999; PackageVersion: Jul-1999; PackageReference: 936A-02; Publisher: Altium Limited; PackageDescription: D2-PAK; 5 Leads; Body 14.7 (inc. leads) x 10.2 mm (LxW max); ComponentLink1Description: Manufacturer Link; ComponentLink1URL: http://www.onsemi.com/site/products/taxonomy/0,4438,503,00.html; ComponentLink2Description: Datasheet; ComponentLink2URL: http://www.onsemi.com/pub/Collateral/LM2576-D.PDF
USB = USB-TYPEB
Y6 Y21 = XTAL: Crystal Oscillator; Published: 8-Jun-2000; LatestRevisionDate: 17-Jul-2002; LatestRevisionNote: Re-released for DXP Platform.; PackageReference: R38; Publisher: Altium Limited; PackageDescription: Crystal, Thru-Hole; 2 Leads; Body 3.1 x 8.2 mm (Dia.xH)